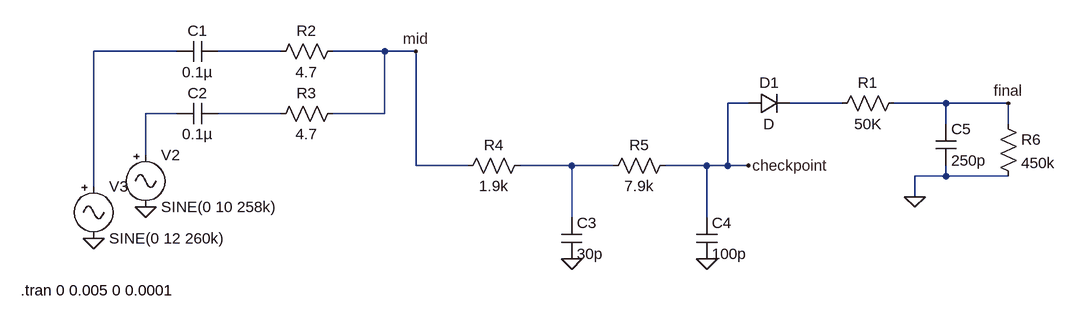
[diagram p0: schematic mixer3.asc]
mixer3.asc, the LTspice schematic file:
Version 4
SHEET 1 1104 708
WIRE -256 272 -384 272
WIRE -96 272 -192 272
WIRE 64 272 -16 272
WIRE 112 272 64 272
WIRE 624 352 592 352
WIRE 768 352 688 352
WIRE 928 352 848 352
WIRE 1024 352 928 352
WIRE -256 368 -304 368
WIRE -96 368 -192 368
WIRE 64 368 64 272
WIRE 64 368 -16 368
WIRE 928 384 928 352
WIRE 1024 384 1024 352
WIRE -304 432 -304 368
WIRE 112 448 112 272
WIRE 192 448 112 448
WIRE 352 448 272 448
WIRE 416 448 352 448
WIRE 560 448 496 448
WIRE 592 448 592 352
WIRE 592 448 560 448
WIRE 624 448 592 448
WIRE 928 464 928 448
WIRE 928 464 880 464
WIRE 1024 464 928 464
WIRE -384 480 -384 272
WIRE 880 496 880 464
WIRE 352 528 352 448
WIRE 560 528 560 448
FLAG -304 512 0
FLAG -384 560 0
FLAG 112 272 mid
FLAG 352 592 0
FLAG 560 592 0
FLAG 624 448 checkpoint
FLAG 880 496 0
FLAG 1024 352 final
SYMBOL res 0 256 R90
WINDOW 0 0 56 VBottom 2
WINDOW 3 32 56 VTop 2
SYMATTR InstName R2
SYMATTR Value 4.7
SYMBOL res 0 352 R90
WINDOW 0 0 56 VBottom 2
WINDOW 3 32 56 VTop 2
SYMATTR InstName R3
SYMATTR Value 4.7
SYMBOL cap -192 256 R90
WINDOW 0 0 32 VBottom 2
WINDOW 3 32 32 VTop 2
SYMATTR InstName C1
SYMATTR Value 0.1µ
SYMBOL cap -192 352 R90
WINDOW 0 0 32 VBottom 2
WINDOW 3 32 32 VTop 2
SYMATTR InstName C2
SYMATTR Value 0.1µ
SYMBOL Misc\\signal -304 416 R0
WINDOW 123 0 0 Left 0
WINDOW 39 0 0 Left 0
SYMATTR InstName V2
SYMATTR Value SINE(0 10 258k)
SYMBOL Misc\\signal -384 464 R0
WINDOW 123 0 0 Left 0
WINDOW 39 0 0 Left 0
SYMATTR InstName V3
SYMATTR Value SINE(0 12 260k)
SYMBOL cap 336 528 R0
SYMATTR InstName C3
SYMATTR Value 30p
SYMBOL cap 544 528 R0
SYMATTR InstName C4
SYMATTR Value 100p
SYMBOL res 288 432 R90
WINDOW 0 0 56 VBottom 2
WINDOW 3 32 56 VTop 2
SYMATTR InstName R4
SYMATTR Value 1.9k
SYMBOL res 512 432 R90
WINDOW 0 0 56 VBottom 2
WINDOW 3 32 56 VTop 2
SYMATTR InstName R5
SYMATTR Value 7.9k
SYMBOL diode 624 368 R270
WINDOW 0 32 32 VTop 2
WINDOW 3 0 32 VBottom 2
SYMATTR InstName D1
SYMBOL cap 912 384 R0
SYMATTR InstName C5
SYMATTR Value 250p
SYMBOL res 1008 368 R0
SYMATTR InstName R6
SYMATTR Value 450k
SYMBOL res 864 336 R90
WINDOW 0 0 56 VBottom 2
WINDOW 3 32 56 VTop 2
SYMATTR InstName R1
SYMATTR Value 50K
TEXT -496 640 Left 2 !.tran 0 0.005 0 0.0001

The netlist it stands for:
* mixer3.asc
R2 mid N002 4.7
R3 mid N005 4.7
C1 N002 N001 0.1µ
C2 N005 N004 0.1µ
V2 N004 0 SINE(0 10 258k)
V3 N001 0 SINE(0 12 260k)
C3 N006 0 30p
C4 checkpoint 0 100p
R4 N006 mid 1.9k
R5 checkpoint N006 7.9k
D1 checkpoint N003 D
C5 final 0 250p
R6 final 0 450k
R1 final N003 50K
.model D D
.lib standard.dio
.tran 0 0.005 0 0.0001
.backanno
.end